# Altium schematic sheet LoRa.SchDoc
size 152 x 88 mm; SheetNumber: 2; SheetTotal: 8
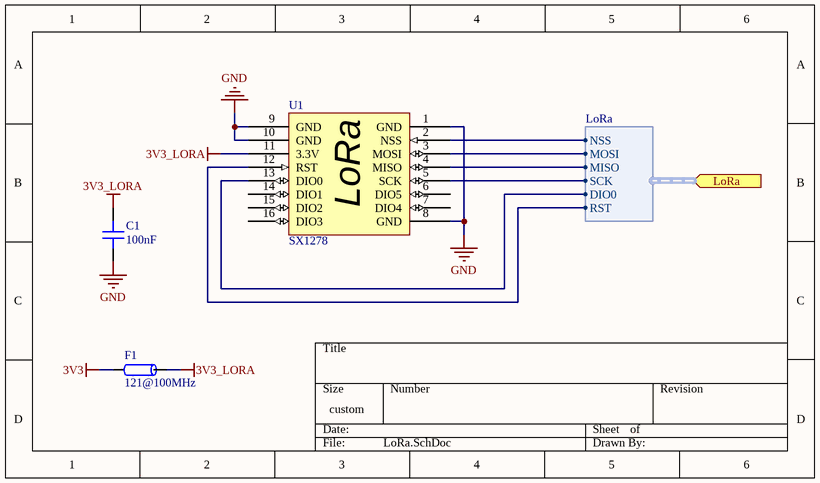
[diagram p0: LoRa.SchDoc]

## Parts
C1  100nF  [CAP 0603_1608]
F1  121@100MHz  [Ferrite-0805]
U1  SX1278  [LoRa-Ra-02]

## Ports
LoRa (in, harness LoRa)

## Harnesses
LoRa: SCK, MISO, MOSI, NSS, DIO0, RST

## Nets
3V3: F1.1
3V3_LORA: C1.2 F1.2 U1.11(3.3V)
GND: C1.1 U1.1(GND) U1.8(GND) U1.9(GND) U1.10(GND)
NetU1_2: U1.2(NSS) ; port LoRa.NSS
NetU1_3: U1.3(MOSI) ; port LoRa.MOSI
NetU1_4: U1.4(MISO) ; port LoRa.MISO
NetU1_5: U1.5(SCK) ; port LoRa.SCK
NetU1_12: U1.12(RST) ; port LoRa.RST
NetU1_13: U1.13(DIO0) ; port LoRa.DIO0

Not connected (* = marked no-connect by the designer): U1 6(DIO5) 7(DIO4) 14(DIO1) 15(DIO2) 16(DIO3)

## Notes on the sheet
- (in symbol LoRa Ra-02) LoRa

## Library data of the parts
C1 = Cap 0603: SMT Capacitor; VALUE: 100nF
F1 = Ferrite Bead
U1 = LoRa Ra-02